# EAGLE schematic Roomba (EAGLE 9.6.2)
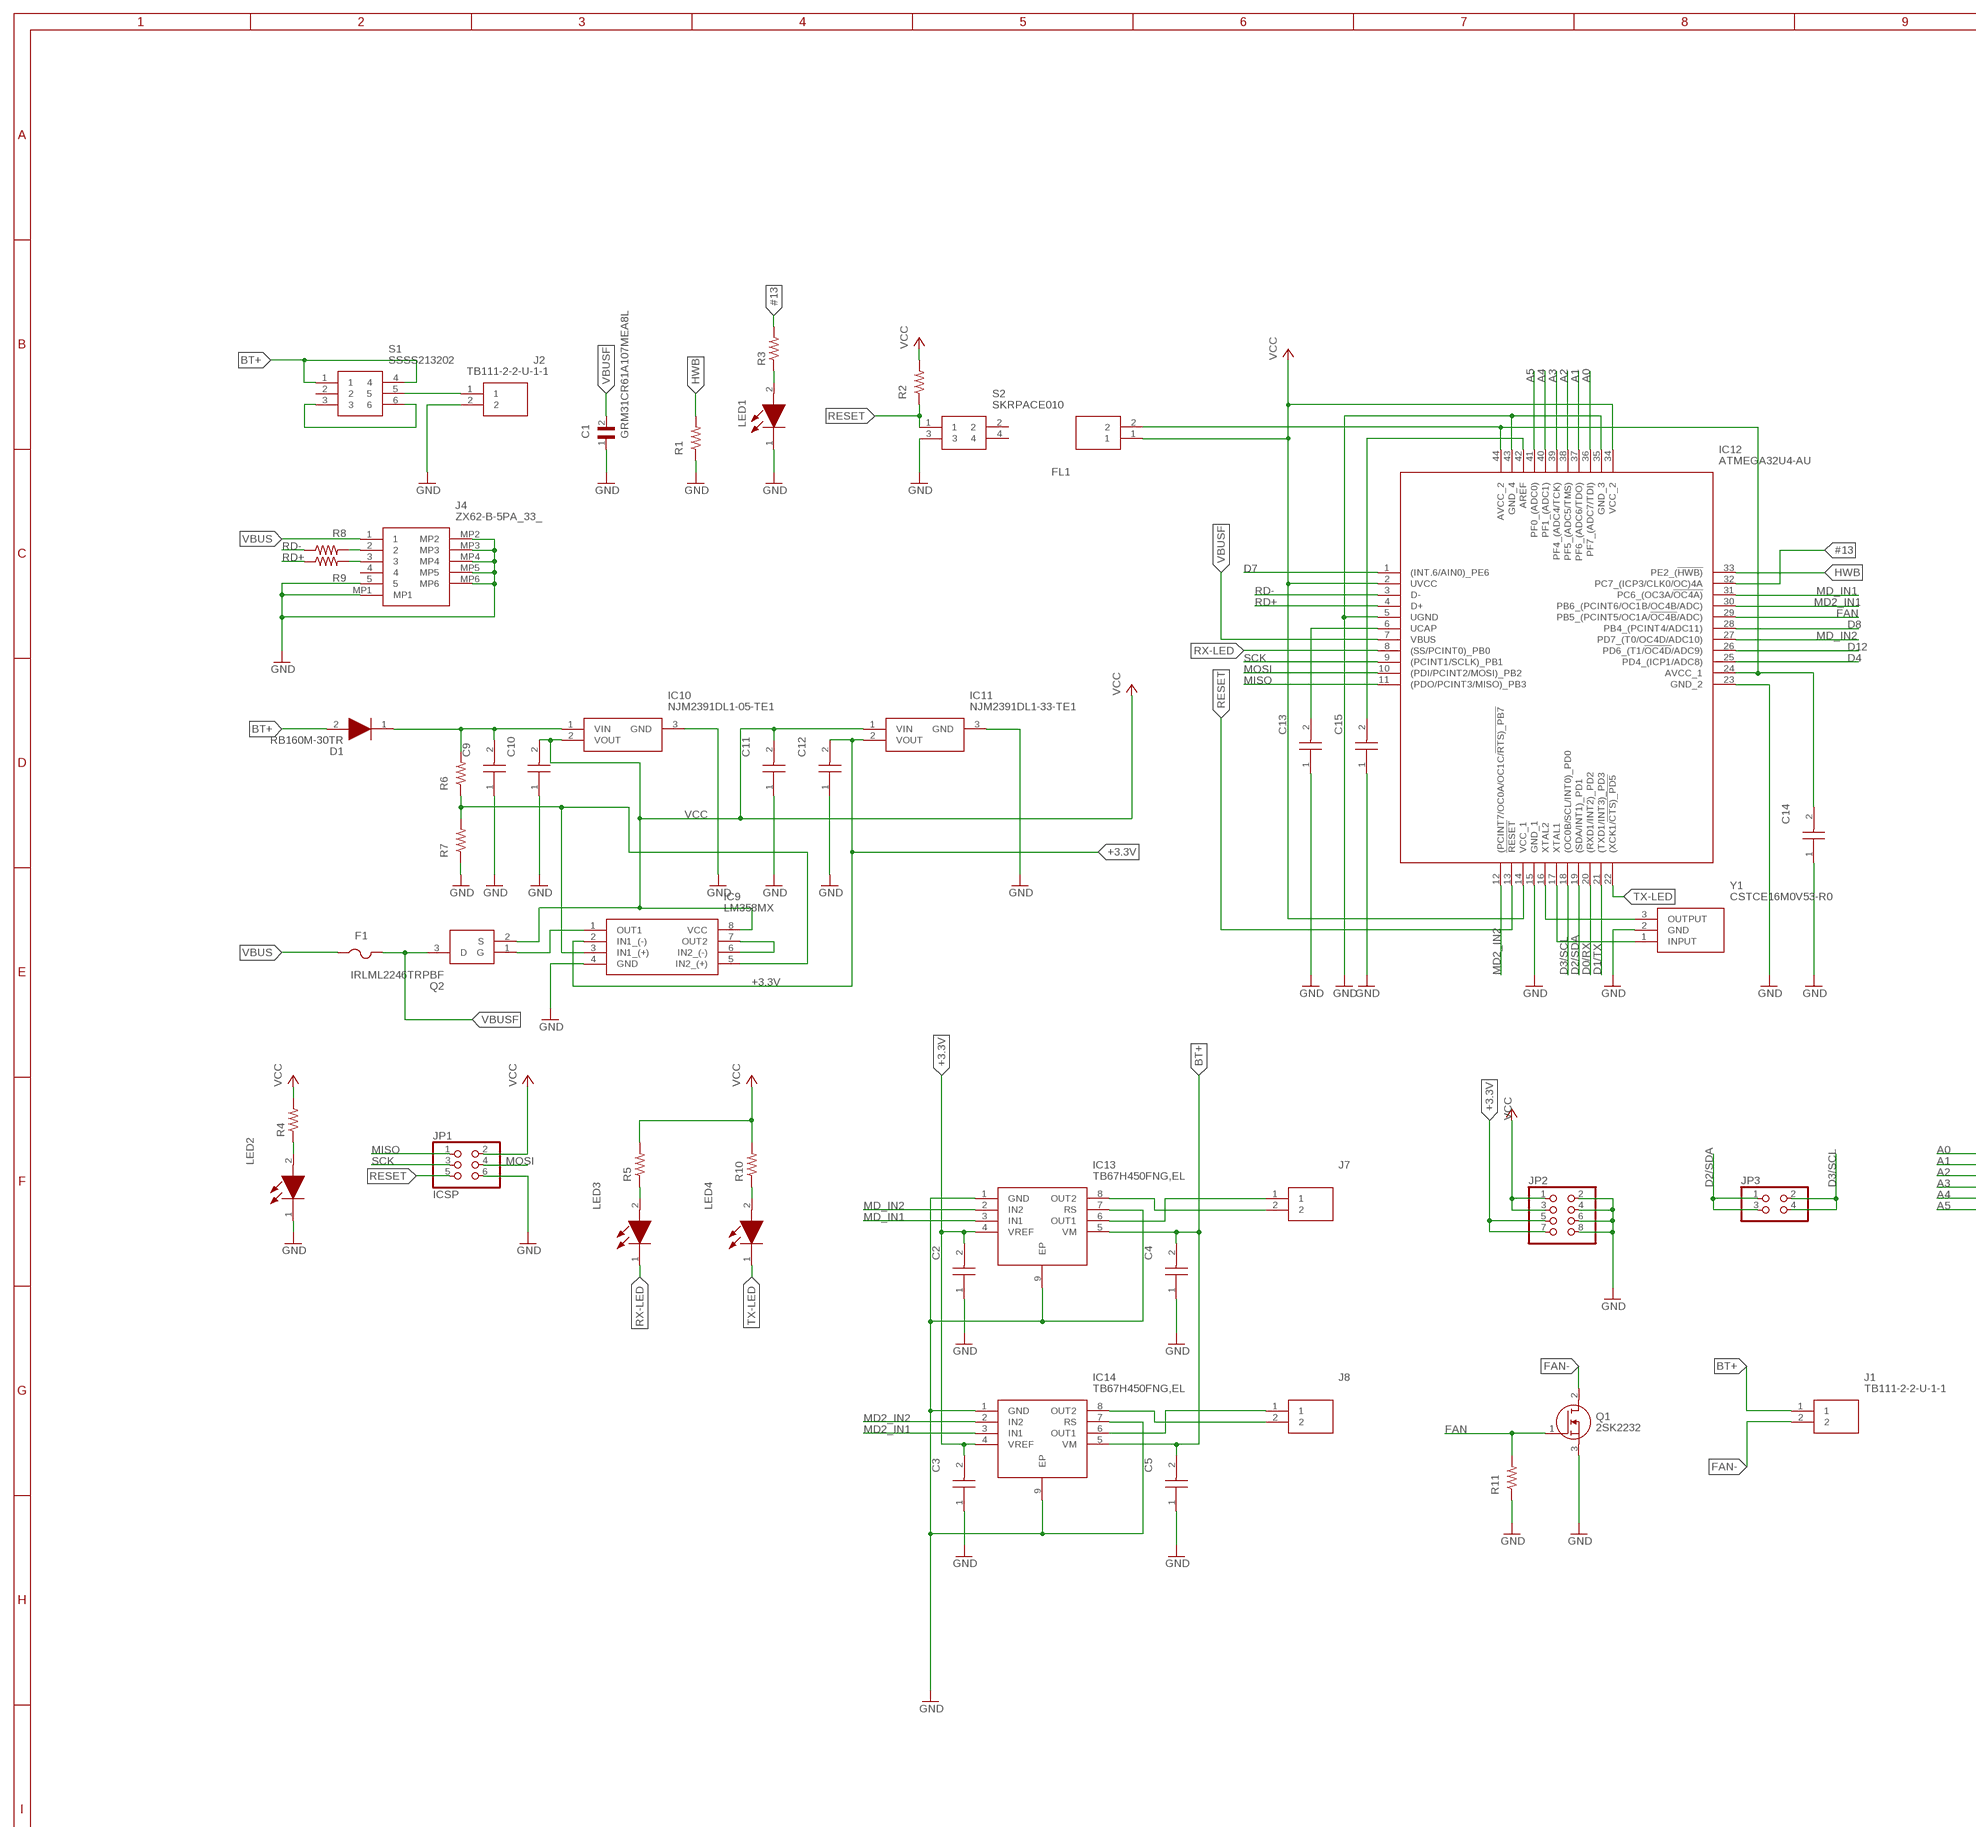
[diagram p0: schematic, sheet 1, part 1 of 2]
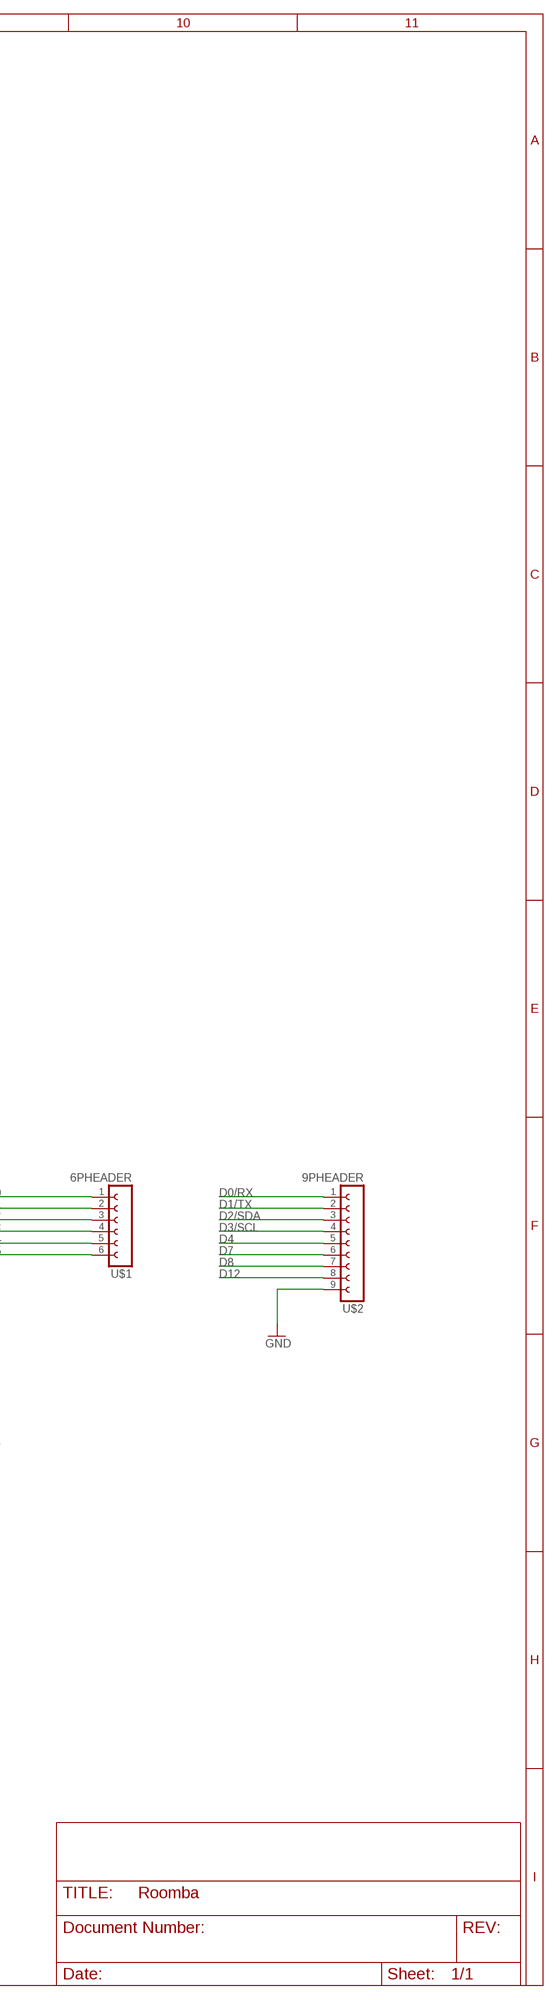
[diagram p1: schematic, sheet 1, part 2 of 2]

## Parts
C1  GRM31CR61A107MEA8L  [CAPC3216X190N]
C2  GRM188F11H104ZA01B  [CAPC1608X90N]
C3  GRM188F11H104ZA01B  [CAPC1608X90N]
C4  GRM188F11H104ZA01B  [CAPC1608X90N]
C5  GRM188F11H104ZA01B  [CAPC1608X90N]
C9  GRM188F11H104ZA01B  [CAPC1608X90N]
C10  GRM31CB31A476KE15L  [CAPC3216X180N]
C11  GRM188F11H104ZA01B  [CAPC1608X90N]
C12  GRM31CB31A476KE15L  [CAPC3216X180N]
C13  GRM188R71E105KA12D  [CAPC1608X90N]
C14  GRM188R71E105KA12D  [CAPC1608X90N]
C15  GRM188F11H104ZA01B  [CAPC1608X90N]
D1  RB160M-30TR  [SODFL3516X90N]
F1  MF-MSMF010-2  [FUSC4632X110N]
FL1  BLM18PG600SN1D  [BLM18AG102BH1D]
IC9  LM358MX  [SOIC127P600X175-8N]
IC10  NJM2391DL1-05-TE1  [TO-252-3-L1_1]
IC11  NJM2391DL1-33-TE1  [TO-252-3-L1]
IC12  ATMEGA32U4-AU  [QFP80P1200X1200X120-44N]
IC13  TB67H450FNG,EL  [SOIC127P600X175-9N]
IC14  TB67H450FNG,EL  [SOIC127P600X175-9N]
J1  TB111-2-2-U-1-1  [TB11122U11]
J2  TB111-2-2-U-1-1  [TB11122U11]
J4  ZX62-B-5PA_33_  [ZX62B5PA33]
J7  TB111-2-2-U-1-1  [TB11122U11]
J8  TB111-2-2-U-1-1  [TB11122U11]
JP1  ICSP  PINHD-2X3  [2X03]
JP2  POWER  PINHD-2X4  [2X04]
JP3  I2C  PINHD-2X2  [2X02]
LED1  SML-E12Y8WT86  [SMLE12Y8WT86]
LED2  SML-E12P8WT86  [LEDC1608X36N]
LED3  SML-E12Y8WT86  [SMLE12Y8WT86]
LED4  SML-E12Y8WT86  [SMLE12Y8WT86]
Q1  2SK2232  [TO254P470X1000X2090-3P]
Q2  IRLML2246TRPBF  [SOT95P237X112-3N]
R1  CRCW120610K0FKEA  [RESC3216X60N]
R2  CRCW120610K0FKEA  [RESC3216X60N]
R3  CRCW12061K00FKEA  [RESC3216X60N]
R4  CRCW12061K00FKEA  [RESC3216X60N]
R5  CRCW12061K00FKEA  [RESC3216X60N]
R6  CRCW120610K0FKEA  [RESC3216X60N]
R7  CRCW120610K0FKEA  [RESC3216X60N]
R8  CRCW120622R0FKEA  [RESC3216X60N]
R9  CRCW120622R0FKEA  [RESC3216X60N]
R10  CRCW12061K00FKEA  [RESC3216X60N]
R11  CRCW120610K0FKEA  [RESC3216X60N]
S1  SSSS213202  [SSSS213202]
S2  SKRPACE010  [SMT(4.2X3.2)]
U$1  6PHEADER  [HDRVR6W70P254_1X6_1574X250X850B]
U$2  9PHEADER  [HDRVR9W70P254_1X9_2336X250X850B]
Y1  CSTCE16M0V53-R0  [CSTCE16M0V53R0]

## Nets
#13: IC12.32(PC7_(ICP3/CLK0/OC)4A) R3.2
+3.3V: C2.2 C3.2 C12.2 IC9.2(IN1_(-)) IC11.2(VOUT) IC13.4(VREF) IC14.4(VREF) JP2.5 JP2.7
A0: IC12.36(PF7_(ADC7/TDI)) U$1.1
A1: IC12.37(PF6_(ADC6/TDO)) U$1.2
A2: IC12.38(PF5_(ADC5/TMS)) U$1.3
A3: IC12.39(PF4_(ADC4/TCK)) U$1.4
A4: IC12.40(PF1_(ADC1)) U$1.5
A5: IC12.41(PF0_(ADC0)) U$1.6
BT+: C4.2 C5.2 D1.2(A) IC13.5(VM) IC14.5(VM) J1.1 S1.1 S1.4
D0/RX: IC12.20((RXD1/INT2)_PD2) U$2.1
D1/TX: IC12.21((TXD1/INT3)_PD3) U$2.2
D2/SDA: IC12.19((SDA/INT1)_PD1) JP3.1 JP3.3 U$2.3
D3/SCL: IC12.18((OC0B/SCL/INT0)_PD0) JP3.2 JP3.4 U$2.4
D4: IC12.25(PD4_(ICP1/ADC8)) U$2.5
D7: IC12.1((INT.6/AIN0)_PE6) U$2.6
D8: IC12.28(PB4_(PCINT4/ADC11)) U$2.7
D12: IC12.26(PD6_(T1/!OC4D!/ADC9)) U$2.8
FAN: IC12.29(PB5_(PCINT5/OC1A/!OC4B!/ADC)) Q1.1(G) R11.2
FAN-: J1.2 Q1.2(D)
GND: C1.1 C2.1 C3.1 C4.1 C5.1 C9.1 C10.1 C11.1 C12.1 C13.1 C14.1 C15.1 IC9.4(GND) IC10.3(GND) IC11.3(GND) IC12.5(UGND) IC12.15(GND_1) IC12.23(GND_2) IC12.35(GND_3) IC12.43(GND_4) IC13.1(GND) IC13.7(RS) IC13.9(EP) IC14.1(GND) IC14.7(RS) IC14.9(EP) J2.2 J4.5 J4.MP1 J4.MP2 J4.MP3 J4.MP4 J4.MP5 J4.MP6 JP1.6 JP2.2 JP2.4 JP2.6 JP2.8 LED1.1(K) LED2.1(K) Q1.3(S) R1.1 R7.1 R11.1 S2.3 U$2.9 Y1.2(GND)
HWB: IC12.33(PE2_(!HWB)) R1.2
MD2_IN1: IC12.30(PB6_(PCINT6/OC1B/OC4B/ADC)) IC14.3(IN1)
MD2_IN2: IC12.12((PCINT7/OC0A/OC1C/!RTS)_PB7) IC14.2(IN2)
MD_IN1: IC12.31(PC6_(OC3A/!OC4A)) IC13.3(IN1)
MD_IN2: IC12.27(PD7_(T0/OC4D/ADC10)) IC13.2(IN2)
MISO: IC12.11((PDO/PCINT3/MISO)_PB3) JP1.1
MOSI: IC12.10((PDI/PCINT2/MOSI)_PB2) JP1.4
N$1: LED1.2(A) R3.1
N$2: LED2.2(A) R4.1
N$3: LED3.2(A) R5.1
N$4: LED4.2(A) R10.1
N$5: IC9.6(IN2_(-)) IC9.7(OUT2)
N$6: J2.1 S1.5
N$7: S1.3 S1.6
N$15: IC9.3(IN1_(+)) IC9.5(IN2_(+)) R6.1 R7.2
N$16: C9.2 D1.1(K) IC10.1(VIN) R6.2
N$17: IC9.1(OUT1) Q2.1(G)
N$18: J4.2 R8.2
N$19: J4.3 R9.2
N$20: C13.2 IC12.6(UCAP)
N$21: C14.2 FL1.2 IC12.24(AVCC_1) IC12.44(AVCC_2)
N$22: IC12.17(XTAL1) Y1.1(INPUT)
N$23: IC12.16(XTAL2) Y1.3(OUTPUT)
N$24: C15.2 IC12.42(AREF)
N$25: IC13.6(OUT1) J7.1
N$26: IC13.8(OUT2) J7.2
N$27: IC14.8(OUT2) J8.2
N$28: IC14.6(OUT1) J8.1
RD+: IC12.4(D+) R9.1
RD-: IC12.3(D-) R8.1
RESET: IC12.13(!RESET) JP1.5 R2.1 S2.1
RX-LED: IC12.8((SS/PCINT0)_PB0) LED3.1(K)
SCK: IC12.9((PCINT1/SCLK)_PB1) JP1.3
TX-LED: IC12.22((XCK1/!CTS)_PD5) LED4.1(K)
VBUS: F1.1 J4.1
VBUSF: C1.2 F1.2 IC12.7(VBUS) Q2.3(D)
VCC: C10.2 C11.2 FL1.1 IC9.8(VCC) IC10.2(VOUT) IC11.1(VIN) IC12.2(UVCC) IC12.14(VCC_1) IC12.34(VCC_2) JP1.2 JP2.1 JP2.3 Q2.2(S) R2.2 R4.2 R5.2 R10.2
Unconnected: J4.4 S1.2 S2.2 S2.4

## Library data of the parts
C1 = Roomba:GRM31CR61A107MEA8L: Check prices <https://pricing.snapeda.com/parts/GRM31CR61A107MEA8L/Murata/view-part?ref=eda> 100µF 3216 10V; AVAILABILITY: Warning; DESCRIPTION: SMD capacitor X5R(EIA) with capacitance 100uF Tol.20%. Rated voltage 10Vdc 85C; MF: Murata; MP: GRM31CR61A107MEA8L; PACKAGE: 3216 Murata; PRICE: None; PURCHASE-URL: https://pricing.snapeda.com/search/part/GRM31CR61A107MEA8L/?ref=eda
C2-C5 C9 C11 C15 = Roomba:GRM188F11H104ZA01B: Multilayer Ceramic Capacitors MLCC - SMD/SMT 0.1µF 1608 Source: Datasheet <http://componentsearchengine.com/Datasheets/1/GRM188F11H104ZA01B.pdf>; DESCRIPTION: Multilayer Ceramic Capacitors MLCC - SMD/SMT; HEIGHT: 0.9mm; MANUFACTURER_NAME: Murata Electronics; MANUFACTURER_PART_NUMBER: GRM188F11H104ZA01B; MOUSER_PART_NUMBER: N/A; MOUSER_PRICE-STOCK: https://www.mouser.co.uk/ProductDetail/Murata-Electronics/GRM188F11H104ZA01B?qs=UOvNgVTuGCqVoWhVMGXegg%3D%3D
C10 C12 = Roomba:GRM31CB31A476KE15L: Murata GRM31CB31A476KE15L 47F Ceramic Multilayer Capacitor 10V dc +/-10% Tolerance SMD Source: Datasheet <http://www.murata.com/~/media/webrenewal/support/library/catalog/products/capacitor/mlcc/c02e.pdf>; DESCRIPTION: Murata GRM31CB31A476KE15L 47F Ceramic Multilayer Capacitor 10V dc +/-10% Tolerance SMD; HEIGHT: 1.8mm; MANUFACTURER_NAME: Murata Electronics; MANUFACTURER_PART_NUMBER: GRM31CB31A476KE15L; MOUSER_PART_NUMBER: N/A; MOUSER_PRICE-STOCK: https://www.mouser.co.uk/ProductDetail/Murata-Electronics/GRM31CB31A476KE15L/?qs=d0WKAl%252BL4KY0D4rzetl%2F5Q%3D%3D
C13 C14 = Roomba:GRM188R71E105KA12D: Ceramic SMT capacitor 1uF 25Vdc Murata 1608 GRM 1uF Ceramic Multilayer Capacitor, 25 V dc, +125degC, X7R Dielectric, /-10% Source: Datasheet <http://psearch.en.murata.com/capacitor/product/GRM188R71E105KA12#.pdf>; ARROW_PART_NUMBER: GRM188R71E105KA12D; ARROW_PRICE-STOCK: https://www.arrow.com/en/products/grm188r71e105ka12d/murata-manufacturing; DESCRIPTION: Ceramic SMT capacitor 1uF 25Vdc Murata 0603 GRM 1uF Ceramic Multilayer Capacitor, 25 V dc, +125degC, X7R Dielectric, /-10%; HEIGHT: 0.9mm; MANUFACTURER_NAME: Murata Electronics; MANUFACTURER_PART_NUMBER: GRM188R71E105KA12D; MOUSER_PART_NUMBER: 81-GRM188R71E105KA2D; MOUSER_PRICE-STOCK: https://www.mouser.co.uk/ProductDetail/Murata-Electronics/GRM188R71E105KA12D/?qs=62qOe8%2Fl8sHaxJyNXtrK%2FQ%3D%3D
D1 = Roomba:RB160M-30TR: ROHM - RB160M-30TR - DIODE, SCHOTTKY, PMDS Source: Datasheet <https://componentsearchengine.com/Datasheets/2/RB160M-30TR.pdf>; DESCRIPTION: ROHM - RB160M-30TR - DIODE, SCHOTTKY, PMDS; HEIGHT: 0.9mm; MANUFACTURER_NAME: ROHM Semiconductor; MANUFACTURER_PART_NUMBER: RB160M-30TR; MOUSER_PART_NUMBER: 755-RB160M-30TR; MOUSER_PRICE-STOCK: https://www.mouser.co.uk/ProductDetail/ROHM-Semiconductor/RB160M-30TR?qs=4kLU8WoGk0udVOFL%252BfJJKQ%3D%3D
F1 = Roomba:MF-MSMF010-2: PTC Resettable Fuse 0.1A(hold) 0.3A(trip) 60V 40A 0.8W 1.5s 0.7Ohm SMD Solder Pad 1812 T/R Automotive Source: Datasheet <https://www.arrow.com/en/products/mf-msmf010-2/bourns>; ARROW_PART_NUMBER: MF-MSMF010-2; ARROW_PRICE-STOCK: https://www.arrow.com/en/products/mf-msmf010-2/bourns; DESCRIPTION: PTC Resettable Fuse 0.1A(hold) 0.3A(trip) 60V 40A 0.8W 1.5s 0.7Ohm SMD Solder Pad 1812 T/R Automotive; HEIGHT: 1.1mm; MANUFACTURER_NAME: Bourns; MANUFACTURER_PART_NUMBER: MF-MSMF010-2; MOUSER_PART_NUMBER: 652-MF-MSMF010-2; MOUSER_PRICE-STOCK: https://www.mouser.co.uk/ProductDetail/Bourns/MF-MSMF010-2/?qs=mkjPM10ZYVYU4yEEad9W7w%3D%3D
FL1 = Roomba:BLM18PG600SN1D: BLM18_N1D Series EMI Suppression Filter 60(Typ.) at 100MHz 1A @85 Source: Datasheet <https://www.murata.com/en-us/products/productdetail?partno=BLM18PG600SN1#>; ARROW_PART_NUMBER: BLM18PG600SN1D; ARROW_PRICE-STOCK: https://www.arrow.com/en/products/blm18pg600sn1d/murata-manufacturing; DESCRIPTION: BLM18_N1D Series EMI Suppression Filter 60(Typ.) at 100MHz 1A @85; HEIGHT: 0.95mm; MANUFACTURER_NAME: Murata Electronics; MANUFACTURER_PART_NUMBER: BLM18PG600SN1D; MOUSER_PART_NUMBER: 81-BLM11P600S; MOUSER_PRICE-STOCK: https://www.mouser.co.uk/ProductDetail/Murata-Electronics/BLM18PG600SN1D?qs=LbqjZSvnDsxC2SXhhViR%252BA%3D%3D
IC9 = Roomba:LM358MX: ON SEMICONDUCTOR - LM358MX. - OP AMP, 0.6V/uS, SOIC-8, FULL REEL Source: Datasheet <http://www.onsemi.com/pub/Collateral/LM358A-D.pdf>; ARROW_PART_NUMBER: LM358MX; ARROW_PRICE-STOCK: https://www.arrow.com/en/products/lm358mx/on-semiconductor; DESCRIPTION: ON SEMICONDUCTOR - LM358MX. - OP AMP, 0.6V/uS, SOIC-8, FULL REEL; HEIGHT: 1.75mm; MANUFACTURER_NAME: ON Semiconductor; MANUFACTURER_PART_NUMBER: LM358MX; MOUSER_PART_NUMBER: 512-LM358MX; MOUSER_PRICE-STOCK: https://www.mouser.co.uk/ProductDetail/ON-Semiconductor-Fairchild/LM358MX/?qs=k6rL%2Fc%252BPp3K5YsPvcEtWGQ%3D%3D
IC10 = Roomba:NJM2391DL1-05-TE1: LDO Regulator Pos 5V 1A 3-Pin TO-252 New Japan Radio NJM2391DL1-05-TE1, LDO Voltage Regulator, 1A, 5 V +/-1%, 3-Pin TO-252 Source: Datasheet <http://docs-emea.rs-online.com/webdocs/0e6f/0900766b80e6f509.pdf>; DESCRIPTION: LDO Regulator Pos 5V 1A 3-Pin TO-252 New Japan Radio NJM2391DL1-05-TE1, LDO Voltage Regulator, 1A, 5 V +/-1%, 3-Pin TO-252; HEIGHT: mm; MANUFACTURER_NAME: New Japan Radio; MANUFACTURER_PART_NUMBER: NJM2391DL1-05-TE1; MOUSER_PART_NUMBER: 513-NJM2391DL105-TE1; MOUSER_PRICE-STOCK: https://www.mouser.co.uk/ProductDetail/NJR/NJM2391DL1-05-TE1/?qs=7x5O%252BBkfEwv1AzCX%2FO1wrg%3D%3D
IC11 = Roomba:NJM2391DL1-33-TE1: LDO Voltage Regulators LDO Source: Datasheet <https://www.njr.com/semicon/PDF/NJM2391_E.pdf>; DESCRIPTION: LDO Voltage Regulators LDO; HEIGHT: mm; MANUFACTURER_NAME: New Japan Radio; MANUFACTURER_PART_NUMBER: NJM2391DL1-33-TE1; MOUSER_PART_NUMBER: 513-NJM2391DL133-TE1; MOUSER_PRICE-STOCK: https://www.mouser.co.uk/ProductDetail/NJR/NJM2391DL1-33-TE1?qs=l%2FzmVEvW4JpmmNoqbD2bKw%3D%3D
IC12 = Roomba:ATMEGA32U4-AU: MCU AVR 32K FLASH 16MHZ 44-TQFP Atmel ATMEGA32U4-AU, 8bit AVR Microcontroller, 16MHz, 1 kB, 32 kB Flash, 44-Pin TQFP Source: Datasheet <http://www.atmel.com/images/atmel-7766-8-bit-avr-atmega16u4-32u4_summary.pdf>; ARROW_PART_NUMBER: ATMEGA32U4-AU; ARROW_PRICE-STOCK: https://www.arrow.com/en/products/atmega32u4-au/microchip-technology; DESCRIPTION: MCU AVR 32K FLASH 16MHZ 44-TQFP Atmel ATMEGA32U4-AU, 8bit AVR Microcontroller, 16MHz, 1 kB, 32 kB Flash, 44-Pin TQFP; HEIGHT: 1.2mm; MANUFACTURER_NAME: Microchip; MANUFACTURER_PART_NUMBER: ATMEGA32U4-AU; MOUSER_PART_NUMBER: 556-ATMEGA32U4-AU; MOUSER_PRICE-STOCK: https://www.mouser.co.uk/ProductDetail/Microchip-Technology-Atmel/ATMEGA32U4-AU/?qs=SSucg2PyLi7mKWjHIsNJ3w%3D%3D
IC13 IC14 = Roomba:TB67H450FNG,EL: Motor / Motion / Ignition Controllers & Drivers Brushed Motor Driver IC, 50V, 3.5A, TSSOP8 Package, PB-FREE Source: Datasheet <http://toshiba.semicon-storage.com/info/docget.jsp?did=65346&prodName=TB67H450FNG>; ARROW_PART_NUMBER: TB67H450FNG,EL; ARROW_PRICE-STOCK: https://www.arrow.com/en/products/tb67h450fngel/toshiba; DESCRIPTION: Motor / Motion / Ignition Controllers & Drivers Brushed Motor Driver IC, 50V, 3.5A, TSSOP8 Package, PB-FREE; HEIGHT: 1.75mm; MANUFACTURER_NAME: Toshiba; MANUFACTURER_PART_NUMBER: TB67H450FNG,EL; MOUSER_PART_NUMBER: 757-TB67H450FNGEL; MOUSER_PRICE-STOCK: https://www.mouser.co.uk/ProductDetail/Toshiba/TB67H450FNGEL?qs=h6V4JsTaLXeReNg2bp0jug%3D%3D
J1 J2 J7 J8 = Roomba:TB111-2-2-U-1-1: Rated voltage: 300VAC Rated current: 15A Source: Datasheet <https://akizukidenshi.com/download/ds/alphaplus/TB111-2-x-x-x-x.pdf>; DESCRIPTION: Rated voltage: 300VAC Rated current: 15A; HEIGHT: 10mm; MANUFACTURER_NAME: Alphaplus; MANUFACTURER_PART_NUMBER: TB111-2-2-U-1-1
J4 = Roomba:ZX62-B-5PA_33_: USB Connectors MICRO B RECEPT RA SMT BTTM MNT Source: Datasheet <https://www.hirose.com/product/download/?distributor=digikey&type=specSheet&lang=en&num=ZX62-B-5PA(33)>; DESCRIPTION: USB Connectors MICRO B RECEPT RA SMT BTTM MNT; HEIGHT: 3mm; MANUFACTURER_NAME: Hirose; MANUFACTURER_PART_NUMBER: ZX62-B-5PA(33); MOUSER_PART_NUMBER: 798-ZX62-B-5PA33; MOUSER_PRICE-STOCK: https://www.mouser.co.uk/ProductDetail/Hirose-Connector/ZX62-B-5PA33/?qs=IvjI65BR3TWOr0fx8JTXXw%3D%3D
JP1 = pinhead:PINHD-2X3: PIN HEADER
JP2 = pinhead:PINHD-2X4: PIN HEADER
JP3 = pinhead:PINHD-2X2: PIN HEADER
LED1 LED3 LED4 = Roomba:SML-E12Y8WT86: ROHM - SML-E12Y8WT86 - LED, YELLOW, 63MCD, 590NM, 1608 Source: Datasheet <http://www.rohm.com/web/global/datasheet/SML-E12Y8W/sml-e1-e>; ARROW_PART_NUMBER: SML-E12Y8WT86; ARROW_PRICE-STOCK: https://www.arrow.com/en/products/sml-e12y8wt86/rohm-semiconductor; DESCRIPTION: ROHM - SML-E12Y8WT86 - LED, YELLOW, 63MCD, 590NM, 1608; HEIGHT: 0mm; MANUFACTURER_NAME: ROHM Semiconductor; MANUFACTURER_PART_NUMBER: SML-E12Y8WT86; MOUSER_PART_NUMBER: 755-SML-E12Y8WT86; MOUSER_PRICE-STOCK: https://www.mouser.co.uk/ProductDetail/ROHM-Semiconductor/SML-E12Y8WT86/?qs=4kLU8WoGk0tv2Hg21kpX1Q%3D%3D
LED2 = Roomba:SML-E12P8WT86: Standard LEDs - SMD SMD Green 2.5-16 mcd Source: Datasheet <http://rohmfs.rohm.com/en/products/databook/datasheet/opto/led/chip_mono/sml-e1.pdf>; ARROW_PART_NUMBER: SML-E12P8WT86; ARROW_PRICE-STOCK: https://www.arrow.com/en/products/sml-e12p8wt86/rohm-semiconductor; DESCRIPTION: Standard LEDs - SMD SMD Green 2.5-16 mcd; HEIGHT: 0.36mm; MANUFACTURER_NAME: ROHM Semiconductor; MANUFACTURER_PART_NUMBER: SML-E12P8WT86; MOUSER_PART_NUMBER: 755-SML-E12P8WT86; MOUSER_PRICE-STOCK: https://www.mouser.co.uk/ProductDetail/ROHM-Semiconductor/SML-E12P8WT86?qs=4kLU8WoGk0vBFbk40ZI0Fw%3D%3D
Q1 = Roomba:2SK2232: MOSFET N-Ch 60V 25A Rdson 0.046 Ohm Source: Datasheet <https://toshiba.semicon-storage.com/info/docget.jsp?did=13451&prodName=2SK2232>; DESCRIPTION: MOSFET N-Ch 60V 25A Rdson 0.046 Ohm; HEIGHT: 4.7mm; MANUFACTURER_NAME: Toshiba; MANUFACTURER_PART_NUMBER: 2SK2232; MOUSER_PART_NUMBER: 757-2SK2232; MOUSER_PRICE-STOCK: https://www.mouser.co.uk/ProductDetail/Toshiba/2SK2232?qs=8TQFHmocP6zil%2FilSisjDg%3D%3D
Q2 = Roomba:IRLML2246TRPBF: HEXFET Power MOSFET Source: Datasheet; ARROW_PART_NUMBER: IRLML2246TRPBF; ARROW_PRICE-STOCK: https://www.arrow.com/en/products/irlml2246trpbf/infineon-technologies-ag; DESCRIPTION: HEXFET Power MOSFET; HEIGHT: mm; MANUFACTURER_NAME: Infineon; MANUFACTURER_PART_NUMBER: IRLML2246TRPBF; MOUSER_PART_NUMBER: 942-IRLML2246TRPBF; MOUSER_PRICE-STOCK: https://www.mouser.co.uk/ProductDetail/Infineon-IR/IRLML2246TRPBF/?qs=9%252BKlkBgLFf2Ex57ZuAl57A%3D%3D
R1 R2 R6 R7 R11 = Roomba:CRCW120610K0FKEA: CRCW1206 Resistor T/R 0.25W,1%,10K Vishay CRCW Series Thick Film Surface Mount Resistor 1206 Case 10k +/-1% 0.25W +/-100ppm/C Source: Datasheet <http://www.vishay.com/docs/20035/dcrcwe3.pdf>; ARROW_PART_NUMBER: CRCW120610K0FKEA; ARROW_PRICE-STOCK: https://www.arrow.com/en/products/crcw120610k0fkea/vishay; DESCRIPTION: CRCW1206 Resistor T/R 0.25W,1%,10K Vishay CRCW Series Thick Film Surface Mount Resistor 1206 Case 10k +/-1% 0.25W +/-100ppm/C; HEIGHT: 0.6mm; MANUFACTURER_NAME: Vishay; MANUFACTURER_PART_NUMBER: CRCW120610K0FKEA; MOUSER_PART_NUMBER: 71-CRCW1206-10K-E3; MOUSER_PRICE-STOCK: https://www.mouser.co.uk/ProductDetail/Vishay-Dale/CRCW120610K0FKEA/?qs=ODaLBy2SlZHPHItpfGW8KQ%3D%3D
R3-R5 R10 = Roomba:CRCW12061K00FKEA: CRCW1206 Resistor T/R 0.25W,1%,1K Vishay CRCW Series Thick Film Surface Mount Resistor 1206 Case 1k +/-1% 0.25W +/-100ppm/C Source: Datasheet <http://www.vishay.com/docs/20035/dcrcwe3.pdf>; ARROW_PART_NUMBER: CRCW12061K00FKEA; ARROW_PRICE-STOCK: https://www.arrow.com/en/products/crcw12061k00fkea/vishay; DESCRIPTION: CRCW1206 Resistor T/R 0.25W,1%,1K Vishay CRCW Series Thick Film Surface Mount Resistor 1206 Case 1k +/-1% 0.25W +/-100ppm/C; HEIGHT: 0.6mm; MANUFACTURER_NAME: Vishay; MANUFACTURER_PART_NUMBER: CRCW12061K00FKEA; MOUSER_PART_NUMBER: 71-CRCW1206-1.0K-E3; MOUSER_PRICE-STOCK: https://www.mouser.co.uk/ProductDetail/Vishay-Dale/CRCW12061K00FKEA/?qs=3XLFQ9LoC1z3na71DC8h0w%3D%3D
R8 R9 = Roomba:CRCW120622R0FKEA: Vishay CRCW Series Thick Film Surface Mount Resistor 1206 Case 22 +/-1% 0.25W +/-100ppm/C Source: Datasheet <http://www.vishay.com/docs/20035/dcrcwe3.pdf>; ARROW_PART_NUMBER: CRCW120622R0FKEA; ARROW_PRICE-STOCK: https://www.arrow.com/en/products/crcw120622r0fkea/vishay; DESCRIPTION: Vishay CRCW Series Thick Film Surface Mount Resistor 1206 Case 22 +/-1% 0.25W +/-100ppm/C; HEIGHT: 0.6mm; MANUFACTURER_NAME: Vishay; MANUFACTURER_PART_NUMBER: CRCW120622R0FKEA; MOUSER_PART_NUMBER: 71-CRCW1206-22-E3; MOUSER_PRICE-STOCK: https://www.mouser.co.uk/ProductDetail/Vishay-Dale/CRCW120622R0FKEA/?qs=bVxjDPCGUuIVF%2FMyHeEeCg%3D%3D
S1 = Roomba:SSSS213202: Slide Switches 1-pole 2-positions Surface Mount Slide Switch SPDT Maintained 0.3 A Slide Source: Datasheet <http://www.alps.com/prod/info/E/HTML/Switch/Slide/SSSS2/SSSS213202.html#Land Dimensions>; DESCRIPTION: Slide Switches 1-pole 2-positions Surface Mount Slide Switch SPDT Maintained 0.3 A Slide; HEIGHT: mm; MANUFACTURER_NAME: ALPS; MANUFACTURER_PART_NUMBER: SSSS213202; MOUSER_PART_NUMBER: 688-SSSS213202; MOUSER_PRICE-STOCK: https://www.mouser.co.uk/ProductDetail/ALPS/SSSS213202?qs=6EGMNY9ZYDRKFJ9qebDCNQ%3D%3D
S2 = Roomba:SKRPACE010: Tactile Switches 4.2x3.2x2.5mm 260gf Source: Datasheet <http://www.alps.com/prod/info/E/HTML/Tact/SurfaceMount/SKRP/SKRPACE010.html>; ARROW_PART_NUMBER: SKRPACE010; ARROW_PRICE-STOCK: https://www.arrow.com/en/products/skrpace010/alps-electric; DESCRIPTION: Tactile Switches 4.2x3.2x2.5mm 260gf; HEIGHT: mm; MANUFACTURER_NAME: ALPS; MANUFACTURER_PART_NUMBER: SKRPACE010; MOUSER_PART_NUMBER: 688-SKRPACE010; MOUSER_PRICE-STOCK: https://www.mouser.co.uk/ProductDetail/ALPS/SKRPACE010?qs=dHDuPHwQO79W8iY66hDbLQ%3D%3D
U$1 = Roomba:6PHEADER
U$2 = Roomba:9PHEADER
Y1 = Roomba:CSTCE16M0V53-R0: CSTCE16M0V53-R0, Ceramic Resonator, 16MHz Expander 15pF, 3-Pin SMT, 3.2 x 1.3 x 0.9mm Source: Datasheet <https://www.murata.com/en-sg/products/productdetail?partno=CSTCE16M0V53-R0>; DESCRIPTION: CSTCE16M0V53-R0, Ceramic Resonator, 16MHz Expander 15pF, 3-Pin SMT, 3.2 x 1.3 x 0.9mm; HEIGHT: 1mm; MANUFACTURER_NAME: Murata Electronics; MANUFACTURER_PART_NUMBER: CSTCE16M0V53-R0; MOUSER_PART_NUMBER: 81-CSTCE16M0V53-R0; MOUSER_PRICE-STOCK: https://www.mouser.co.uk/ProductDetail/Murata-Electronics/CSTCE16M0V53-R0/?qs=HPA2Xx%252BU0WhPWbRcNuzhZw%3D%3D